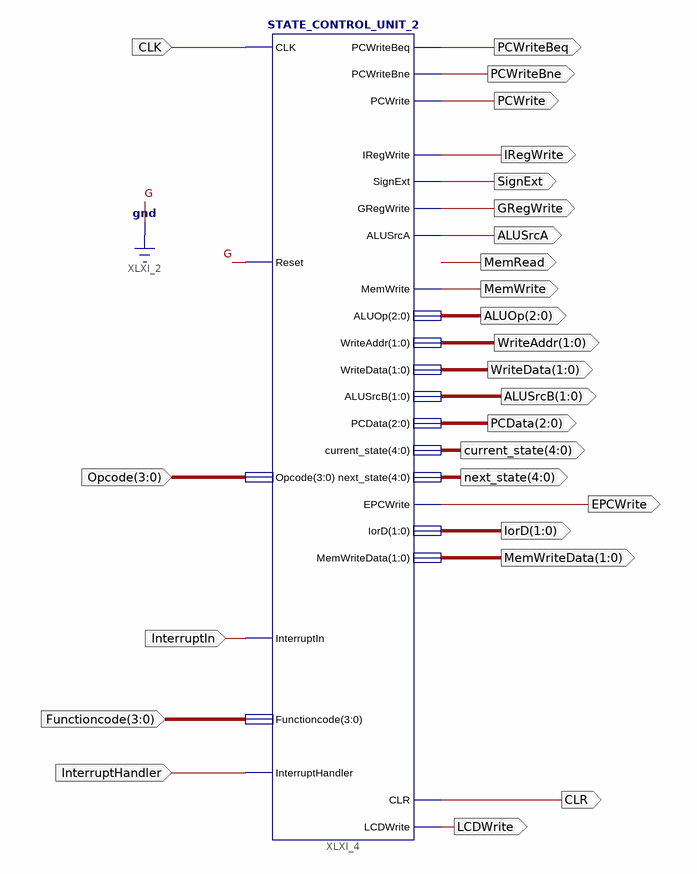
[diagram p0: schematic sheet 1]
// Xilinx ISE schematic Schematic_Control.sch (spartan3e) as structural Verilog: 1 symbols, 26 ports
module Schematic_Control (
  input  [3:0] Opcode,
  input  CLK,
  input  InterruptIn,
  input  [3:0] Functioncode,
  input  InterruptHandler,
  output [4:0] next_state,
  output [4:0] current_state,
  output [2:0] ALUOp,
  output MemWrite,
  output MemRead,
  output [1:0] ALUSrcB,
  output ALUSrcA,
  output GRegWrite,
  output SignExt,
  output IRegWrite,
  output [1:0] IorD,
  output PCWrite,
  output PCWriteBne,
  output PCWriteBeq,
  output [2:0] PCData,
  output [1:0] WriteData,
  output [1:0] WriteAddr,
  output [1:0] MemWriteData,
  output EPCWrite,
  output CLR,
  output LCDWrite
);

  STATE_CONTROL_UNIT_2 XLXI_4 (
    .CLK(CLK), .InterruptIn(InterruptIn), .InterruptHandler(InterruptHandler), .Reset(1'b0), .Opcode(Opcode),
    .Functioncode(Functioncode), .PCWriteBeq(PCWriteBeq), .PCWriteBne(PCWriteBne), .PCWrite(PCWrite),
    .IRegWrite(IRegWrite), .SignExt(SignExt), .GRegWrite(GRegWrite), .ALUSrcA(ALUSrcA), .MemWrite(MemWrite),
    .EPCWrite(EPCWrite), .CLR(CLR), .LCDWrite(LCDWrite), .ALUOp(ALUOp), .IorD(IorD), .WriteAddr(WriteAddr),
    .WriteData(WriteData), .ALUSrcB(ALUSrcB), .PCData(PCData), .current_state(current_state),
    .next_state(next_state), .MemWriteData(MemWriteData));
endmodule
